# Altium schematic sheet S7CAS-PLEIADES-CARTE-MERE_P20_FPGA-Unused-Banks.SchDoc
size Tabloid; SheetNumber: 10; SheetTotal: 20; Sheet_Name: FPGA Unused Banks; Size: 11x17
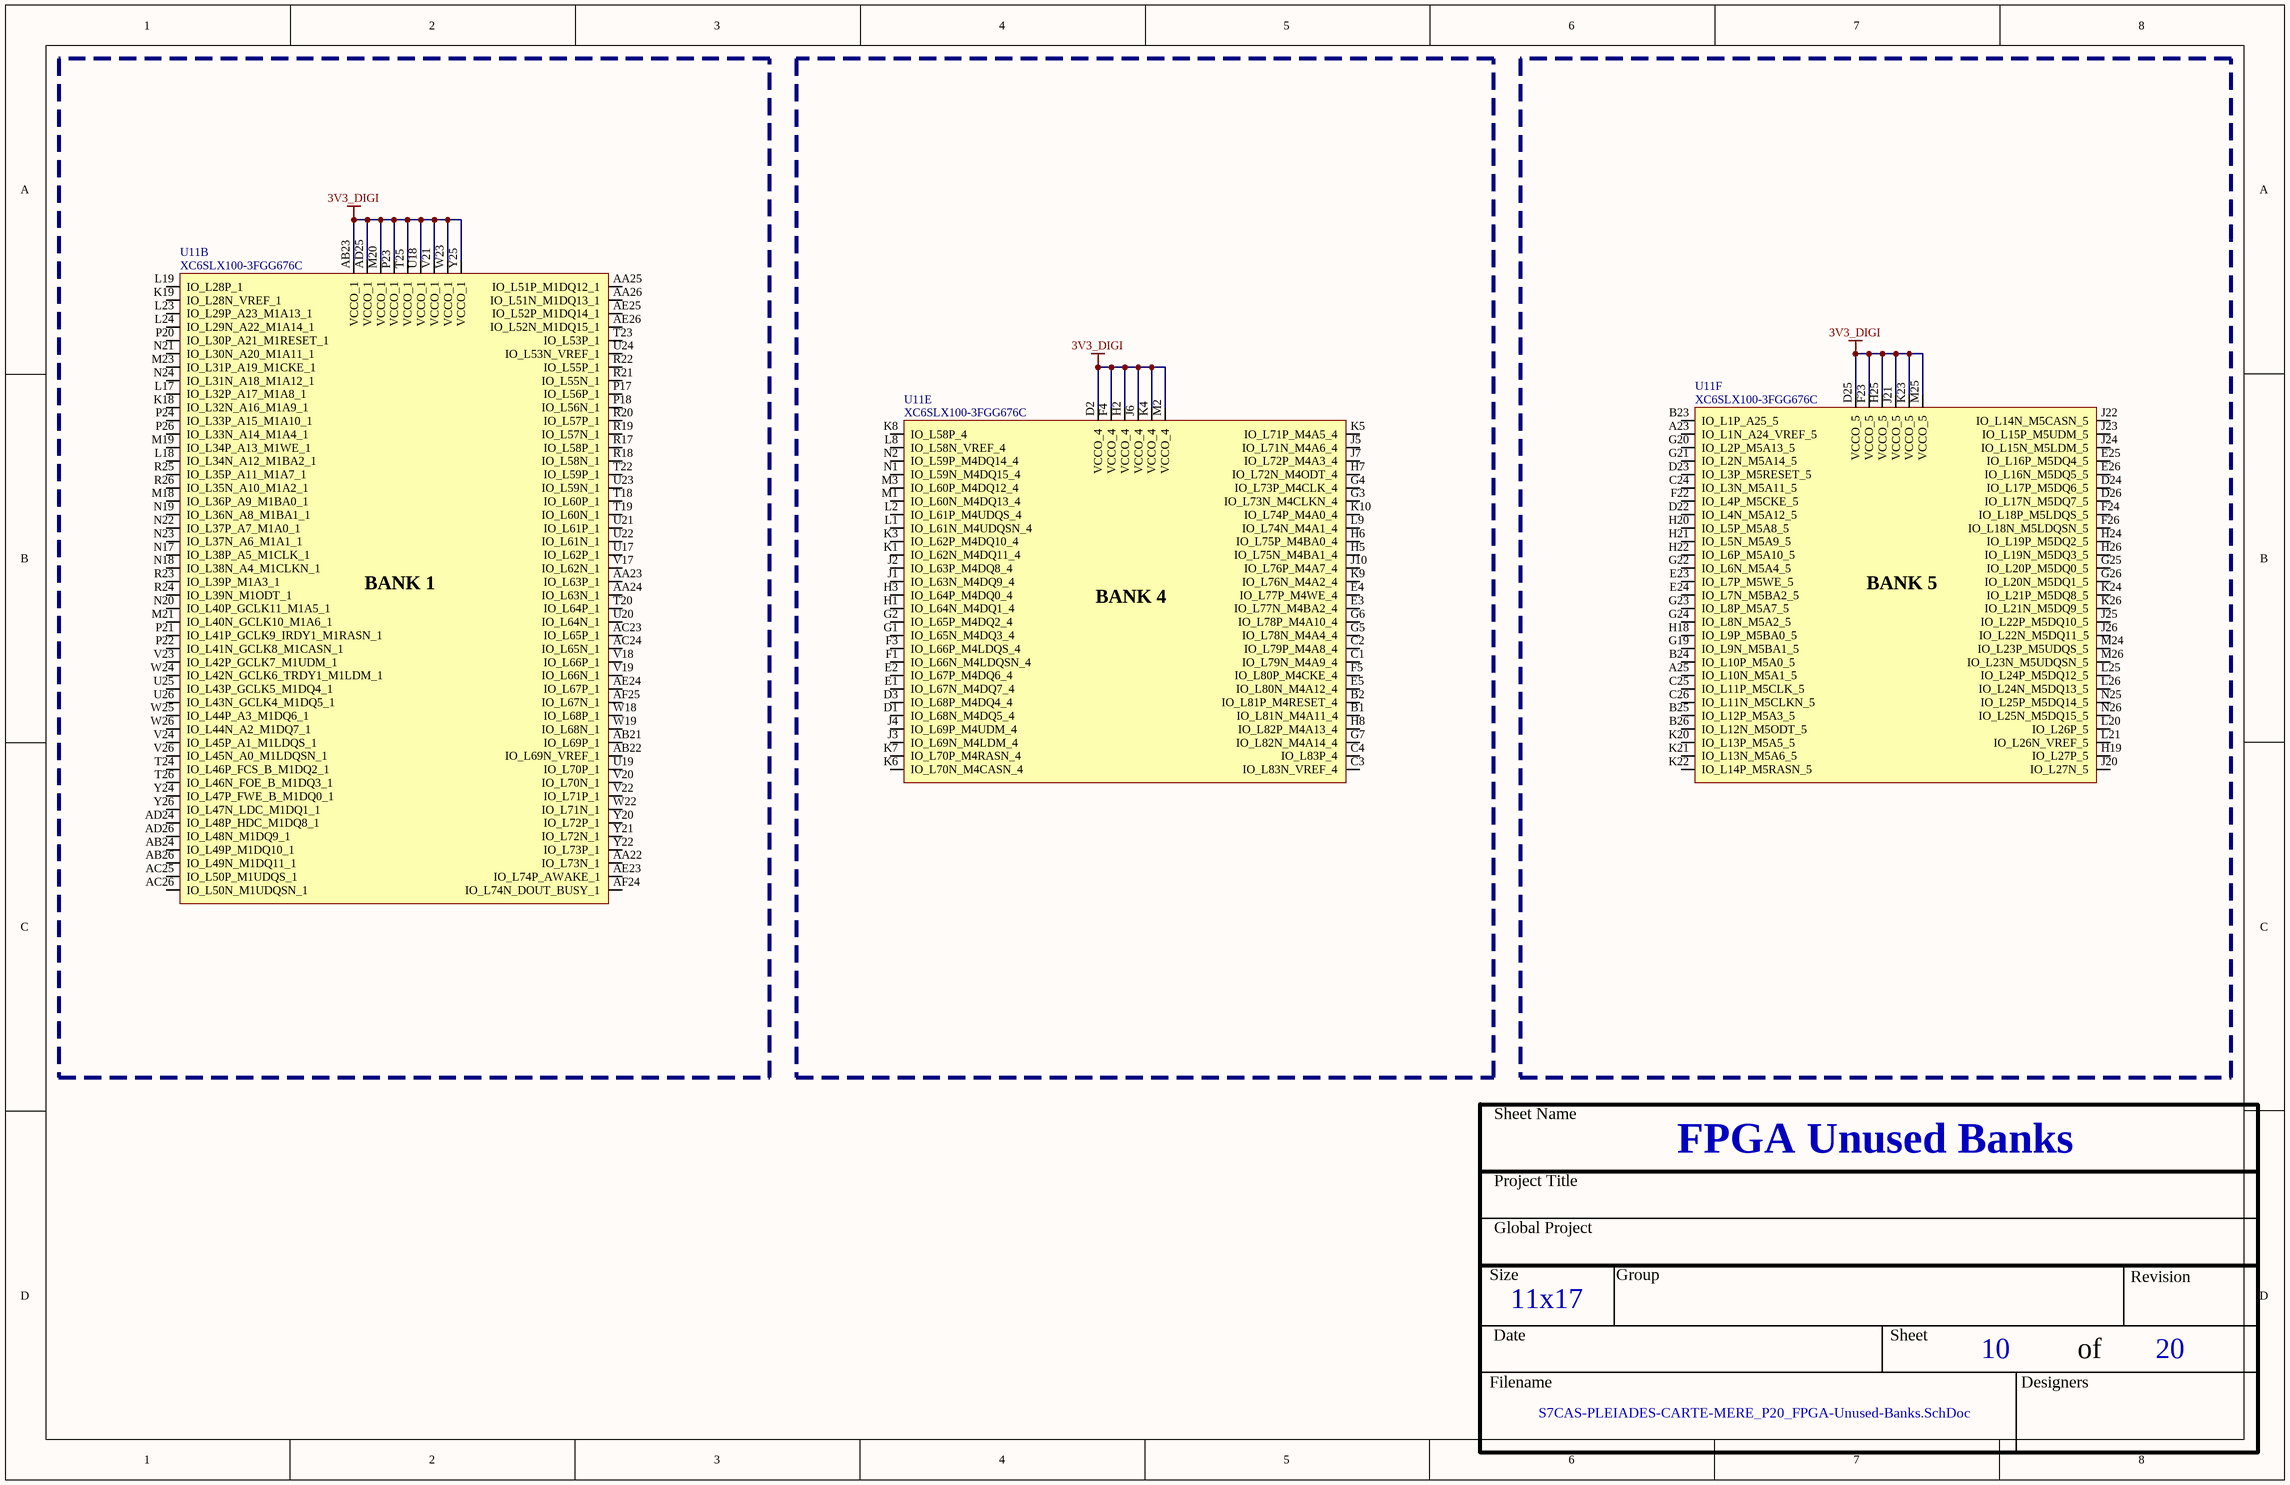
[diagram p0: S7CAS-PLEIADES-CARTE-MERE_P20_FPGA-Unused-Banks.SchDoc]

## Parts
U11  XC6SLX100-3FGG676C  [FPGA_XILINX_FGG676]  (parts B,E,F of 10)

## Nets
3V3_DIGI: U11.AB23(VCCO_1) U11.AD25(VCCO_1) U11.D2(VCCO_4) U11.D25(VCCO_5) U11.F4(VCCO_4) U11.F23(VCCO_5) U11.H2(VCCO_4) U11.H25(VCCO_5) U11.J6(VCCO_4) U11.J21(VCCO_5) U11.K4(VCCO_4) U11.K23(VCCO_5) U11.M2(VCCO_4) U11.M20(VCCO_1) U11.M25(VCCO_5) U11.P23(VCCO_1) U11.T25(VCCO_1) U11.U18(VCCO_1) U11.V21(VCCO_1) U11.W23(VCCO_1) U11.Y25(VCCO_1)

Not connected (* = marked no-connect by the designer): U11 A23(IO_L1N_A24_VREF_5) A25(IO_L10N_M5A1_5) AA22(IO_L73N_1) AA23(IO_L63P_1) AA24(IO_L63N_1) AA25(IO_L51P_M1DQ12_1) AA26(IO_L51N_M1DQ13_1) AB21(IO_L69P_1) AB22(IO_L69N_VREF_1) AB24(IO_L49P_M1DQ10_1) AB26(IO_L49N_M1DQ11_1) AC23(IO_L65P_1) AC24(IO_L65N_1) AC25(IO_L50P_M1UDQS_1) AC26(IO_L50N_M1UDQSN_1) AD24(IO_L48P_HDC_M1DQ8_1) AD26(IO_L48N_M1DQ9_1) AE23(IO_L74P_AWAKE_1) AE24(IO_L67P_1) AE25(IO_L52P_M1DQ14_1) AE26(IO_L52N_M1DQ15_1) AF24(IO_L74N_DOUT_BUSY_1) AF25(IO_L67N_1) B1(IO_L81N_M4A11_4) B2(IO_L81P_M4RESET_4) B23(IO_L1P_A25_5) B24(IO_L10P_M5A0_5) B25(IO_L12P_M5A3_5) B26(IO_L12N_M5ODT_5) C1(IO_L79N_M4A9_4) C2(IO_L79P_M4A8_4) C3(IO_L83N_VREF_4) C4(IO_L83P_4) C24(IO_L3N_M5A11_5) C25(IO_L11P_M5CLK_5) C26(IO_L11N_M5CLKN_5) D1(IO_L68N_M4DQ5_4) D3(IO_L68P_M4DQ4_4) D22(IO_L4N_M5A12_5) D23(IO_L3P_M5RESET_5) D24(IO_L17P_M5DQ6_5) D26(IO_L17N_M5DQ7_5) E1(IO_L67N_M4DQ7_4) E2(IO_L67P_M4DQ6_4) E3(IO_L77N_M4BA2_4) E4(IO_L77P_M4WE_4) E5(IO_L80N_M4A12_4) E23(IO_L7P_M5WE_5) E24(IO_L7N_M5BA2_5) E25(IO_L16P_M5DQ4_5) E26(IO_L16N_M5DQ5_5) F1(IO_L66N_M4LDQSN_4) F3(IO_L66P_M4LDQS_4) F5(IO_L80P_M4CKE_4) F22(IO_L4P_M5CKE_5) F24(IO_L18P_M5LDQS_5) F26(IO_L18N_M5LDQSN_5) G1(IO_L65N_M4DQ3_4) G2(IO_L65P_M4DQ2_4) G3(IO_L73N_M4CLKN_4) G4(IO_L73P_M4CLK_4) G5(IO_L78N_M4A4_4) G6(IO_L78P_M4A10_4) G7(IO_L82N_M4A14_4) G19(IO_L9N_M5BA1_5) G20(IO_L2P_M5A13_5) G21(IO_L2N_M5A14_5) G22(IO_L6N_M5A4_5) G23(IO_L8P_M5A7_5) G24(IO_L8N_M5A2_5) G25(IO_L20P_M5DQ0_5) G26(IO_L20N_M5DQ1_5) H1(IO_L64N_M4DQ1_4) H3(IO_L64P_M4DQ0_4) H5(IO_L75N_M4BA1_4) H6(IO_L75P_M4BA0_4) H7(IO_L72N_M4ODT_4) H8(IO_L82P_M4A13_4) H18(IO_L9P_M5BA0_5) H19(IO_L27P_5) H20(IO_L5P_M5A8_5) H21(IO_L5N_M5A9_5) H22(IO_L6P_M5A10_5) H24(IO_L19P_M5DQ2_5) H26(IO_L19N_M5DQ3_5) J1(IO_L63N_M4DQ9_4) J2(IO_L63P_M4DQ8_4) J3(IO_L69N_M4LDM_4) J4(IO_L69P_M4UDM_4) J5(IO_L71N_M4A6_4) J7(IO_L72P_M4A3_4) J10(IO_L76P_M4A7_4) J20(IO_L27N_5) J22(IO_L14N_M5CASN_5) J23(IO_L15P_M5UDM_5) J24(IO_L15N_M5LDM_5) J25(IO_L22P_M5DQ10_5) J26(IO_L22N_M5DQ11_5) K1(IO_L62N_M4DQ11_4) K3(IO_L62P_M4DQ10_4) K5(IO_L71P_M4A5_4) K6(IO_L70N_M4CASN_4) K7(IO_L70P_M4RASN_4) K8(IO_L58P_4) K9(IO_L76N_M4A2_4) K10(IO_L74P_M4A0_4) K18(IO_L32N_A16_M1A9_1) K19(IO_L28N_VREF_1) K20(IO_L13P_M5A5_5) K21(IO_L13N_M5A6_5) K22(IO_L14P_M5RASN_5) K24(IO_L21P_M5DQ8_5) K26(IO_L21N_M5DQ9_5) L1(IO_L61N_M4UDQSN_4) L2(IO_L61P_M4UDQS_4) L8(IO_L58N_VREF_4) L9(IO_L74N_M4A1_4) L17(IO_L32P_A17_M1A8_1) L18(IO_L34N_A12_M1BA2_1) L19(IO_L28P_1) L20(IO_L26P_5) L21(IO_L26N_VREF_5) L23(IO_L29P_A23_M1A13_1) L24(IO_L29N_A22_M1A14_1) L25(IO_L24P_M5DQ12_5) L26(IO_L24N_M5DQ13_5) M1(IO_L60N_M4DQ13_4) M3(IO_L60P_M4DQ12_4) M18(IO_L36P_A9_M1BA0_1) M19(IO_L34P_A13_M1WE_1) M21(IO_L40N_GCLK10_M1A6_1) M23(IO_L31P_A19_M1CKE_1) M24(IO_L23P_M5UDQS_5) M26(IO_L23N_M5UDQSN_5) N1(IO_L59N_M4DQ15_4) N2(IO_L59P_M4DQ14_4) N17(IO_L38P_A5_M1CLK_1) N18(IO_L38N_A4_M1CLKN_1) N19(IO_L36N_A8_M1BA1_1) N20(IO_L40P_GCLK11_M1A5_1) N21(IO_L30N_A20_M1A11_1) N22(IO_L37P_A7_M1A0_1) N23(IO_L37N_A6_M1A1_1) N24(IO_L31N_A18_M1A12_1) N25(IO_L25P_M5DQ14_5) N26(IO_L25N_M5DQ15_5) P17(IO_L56P_1) P18(IO_L56N_1) P20(IO_L30P_A21_M1RESET_1) P21(IO_L41P_GCLK9_IRDY1_M1RASN_1) P22(IO_L41N_GCLK8_M1CASN_1) P24(IO_L33P_A15_M1A10_1) P26(IO_L33N_A14_M1A4_1) R17(IO_L58P_1) R18(IO_L58N_1) R19(IO_L57N_1) R20(IO_L57P_1) R21(IO_L55N_1) R22(IO_L55P_1) R23(IO_L39P_M1A3_1) R24(IO_L39N_M1ODT_1) R25(IO_L35P_A11_M1A7_1) R26(IO_L35N_A10_M1A2_1) T18(IO_L60P_1) T19(IO_L60N_1) T20(IO_L64P_1) T22(IO_L59P_1) T23(IO_L53P_1) T24(IO_L46P_FCS_B_M1DQ2_1) T26(IO_L46N_FOE_B_M1DQ3_1) U17(IO_L62P_1) U19(IO_L70P_1) U20(IO_L64N_1) U21(IO_L61P_1) U22(IO_L61N_1) U23(IO_L59N_1) U24(IO_L53N_VREF_1) U25(IO_L43P_GCLK5_M1DQ4_1) U26(IO_L43N_GCLK4_M1DQ5_1) V17(IO_L62N_1) V18(IO_L66P_1) V19(IO_L66N_1) V20(IO_L70N_1) V22(IO_L71P_1) V23(IO_L42P_GCLK7_M1UDM_1) V24(IO_L45P_A1_M1LDQS_1) V26(IO_L45N_A0_M1LDQSN_1) W18(IO_L68P_1) W19(IO_L68N_1) W22(IO_L71N_1) W24(IO_L42N_GCLK6_TRDY1_M1LDM_1) W25(IO_L44P_A3_M1DQ6_1) W26(IO_L44N_A2_M1DQ7_1) Y20(IO_L72P_1) Y21(IO_L72N_1) Y22(IO_L73P_1) Y24(IO_L47P_FWE_B_M1DQ0_1) Y26(IO_L47N_LDC_M1DQ1_1)

## Notes on the sheet
- Sheet Name
- Project Title
- Global Project
- Size
- Group
- Revision
- Date
- Sheet
- of
- Filename
- Designers
- (in symbol FPGA_XC6SLX100-3FGG676C, part B) BANK 1
- (in symbol FPGA_XC6SLX100-3FGG676C, part E) BANK 4
- (in symbol FPGA_XC6SLX100-3FGG676C, part F) BANK 5

## Library data of the parts
U11 = FPGA_XC6SLX100-3FGG676C: FPGA - XILINX SPARTAN 6 480 I/O - BGA-676; Voltage: 1.14 V ~ 1.26 V; Current: *; Power: *; Mfg: Xilinx; Mfg Part Number: XC6SLX100-3FGG676C; HelpURL: https://www.xilinx.com/support/documentation/data_sheets/ds162.pdf; CreatedBy: Jonathan Bouchard; Temperature: 0°C ~ 85°C (TJ); Value: *; Precision: *; Package: BGA-676; Supplier 1: Digikey; Supplier Part Number 1: 122-1760-ND